# EAGLE design STAND_ALONE_TEST (EAGLE 6.2)
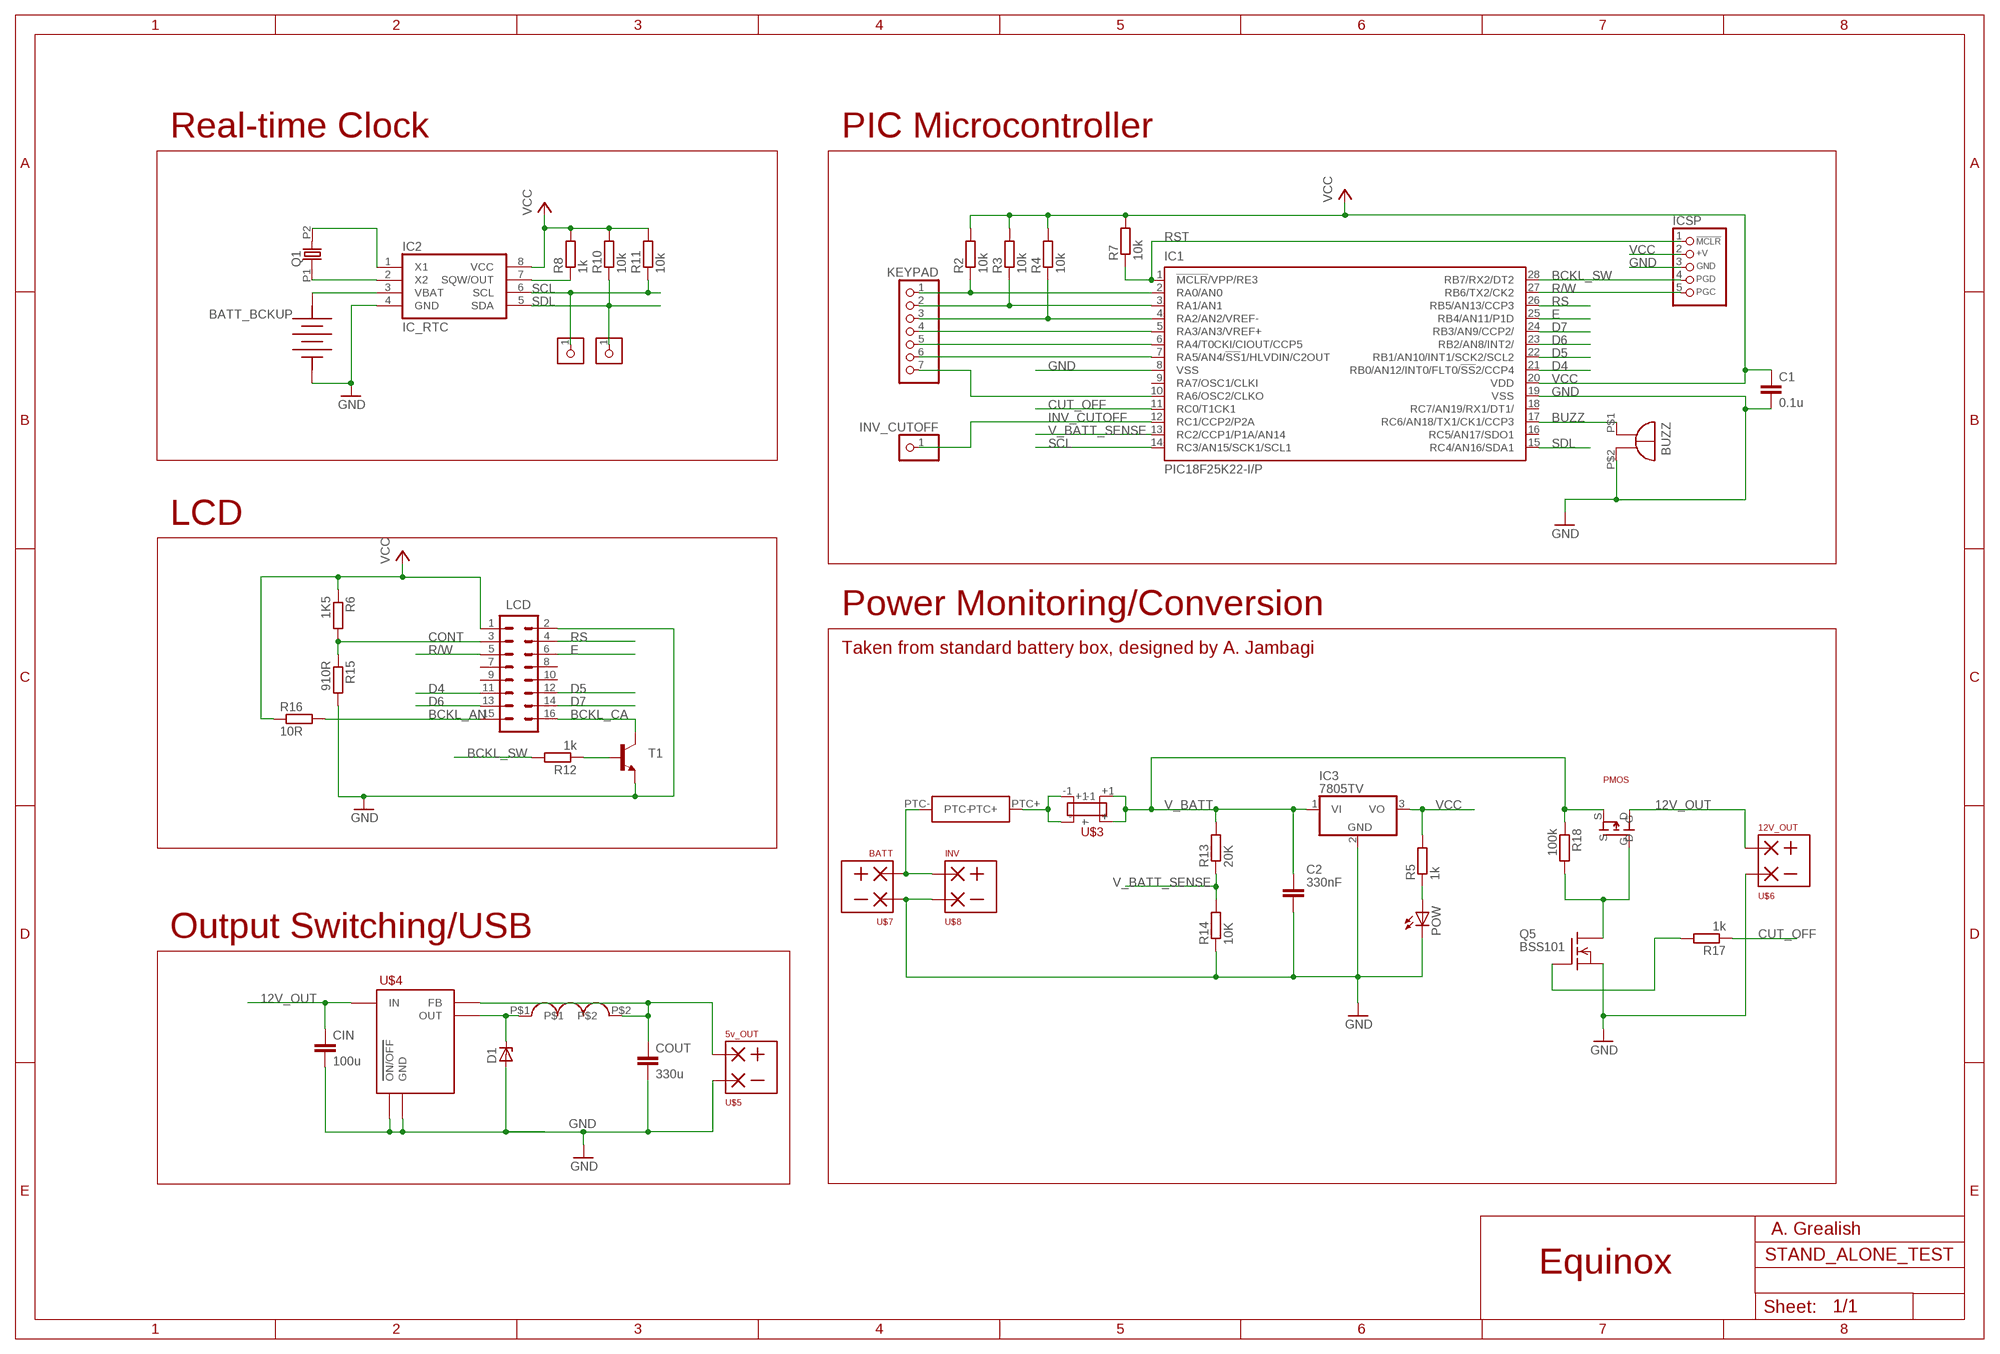
[diagram p0: schematic, sheet 1]

## Parts
BATT_BCKUP  RENATA_COIN_CELL  PANASONIC_CR2032_1298246  [PANASONIC_CR2032_1298246]
BUZZ  BUZZ_14MM  [14MM_5M_PINS]
C1  0.1u  CAPPTH2  [CAP-PTH-SMALL2]
C2  330nF  CAPACITOR_NPOL-PTH_0.1"  [C0.1PTH]
CIN  100u  C2.5/2  [C2.5-2]
COUT  330u  C2.5/2  [C2.5-2]
D1  ZENER-DIODEDO41Z10  [DO41Z10]
IC1  PIC18F25K22-I/P  [DIP28]
IC2  IC_RTC  IC_RTC_DS1307_DIP8  [DIP8]
IC3  7805TV  [TO220V]
ICSP  CON_HEADER_PRG_PIC_ICSPA  [HEADER_PRG_1X05]
INV_CUTOFF  PINHD-1X1  [1X01]
KEYPAD  PINHD-1X7  [1X07]
LCD  M08X2-SHROUDED_LOCK  [2X8-SHROUDED_LOCK]
PMOS  PMOS  [NMOS_IPAK]
POW  LED5MM  [LED5MM]
Q1  OSC-XTALTC-26  [TC-26]
Q5  BSS101  [TO92]
R2  10k  RESISTOR-PTH-0.4  [RTH025W]
R3  10k  RESISTOR-PTH-0.4  [RTH025W]
R4  10k  RESISTOR-PTH-0.4  [RTH025W]
R5  1k  RESISTOR-PTH-0.4  [RTH025W]
R6  1K5  RESISTOR-PTH-0.4  [RTH025W]
R7  10k  RESISTOR-PTH-0.4  [RTH025W]
R8  1k  RESISTOR-PTH-0.4  [RTH025W]
R10  10k  RESISTOR-PTH-0.4  [RTH025W]
R11  10k  RESISTOR-PTH-0.4  [RTH025W]
R12  1k  RESISTOR-PTH-0.4  [RTH025W]
R13  20K  RESISTOR-PTH-0.4  [RTH025W]
R14  10K  RESISTOR-PTH-0.4  [RTH025W]
R15  910R  RESISTOR-PTH-0.4  [RTH025W]
R16  10R  RESISTOR-PTH-0.4  [RTH025W]
R17  1k  RESISTOR-PTH-0.4  [RTH025W]
R18  100k  RESISTOR-PTH-0.4  [RTH025W]
T1  BC546-NPN-TO92-CBE  [TO92-CBE]
TP_SCL  CON_HEADER_1X01-PTH  [M1X1]
TP_SDL  CON_HEADER_1X01-PTH  [M1X1]
U$1  EQBX_INDUCTOR2  [INDUCTOR]
U$2  EQBX_PTCEQBX_PTC  [EQBX_PTC]
U$3  EQBX_FUSEEQBX_FUSE  [EQBX_FUSE]
U$4  LM2575  [TO220-5]
U$5  5v_OUT  TERMINAL_2WAY  [TERMINAL_2WAY]
U$6  12V_OUT  TERMINAL_2WAY  [TERMINAL_2WAY]
U$7  BATT  TERMINAL_2WAY  [TERMINAL_2WAY]
U$8  INV  TERMINAL_2WAY  [TERMINAL_2WAY]

## Nets
12V_OUT [pow_12v]: CIN.1 PMOS.D U$4.P$1(IN) U$6.P$1
BCKL_AN: LCD.15 R16.2
BCKL_CA: LCD.16 T1.C
BCKL_SW: IC1.28(RB7/RX2/DT2) ICSP.4(PGD) R12.2
BUZZ: BUZZ.P$1(+) IC1.17(RC6/AN18/TX1/CK1/CCP3)
CONT: LCD.3 R6.2 R15.1
CUT_OFF: IC1.11(RC0/T1CK1) R17.1
D4: IC1.21(RB0/AN12/INT0/FLT0/!SS!2/CCP4) LCD.11
D5: IC1.22(RB1/AN10/INT1/SCK2/SCL2) LCD.12
D6: IC1.23(RB2/AN8/INT2/) LCD.13
D7: IC1.24(RB3/AN9/CCP2/) LCD.14
E: IC1.25(RB4/AN11/P1D) LCD.6
GND [gnd]: BATT_BCKUP.P-(NEG) BUZZ.P$2(-) C1.2 C2.2 CIN.2 COUT.2 D1.A IC1.8(VSS) IC1.19(VSS) IC2.4(GND) IC3.2(GND) ICSP.3(GND) LCD.2 POW.K(C) Q5.1(S) R14.1 R15.2 T1.E U$4.P$3(GND) U$4.P$5(ON/OFF) U$5.P$2 U$6.P$2 U$7.P$2 U$8.P$2
INV_CUTOFF: IC1.12(RC1/CCP2/P2A) INV_CUTOFF.1
N$1: PMOS.G Q5.3(D) R18.2
N$2: R12.1 T1.B
N$4 [pow_12v]: U$2.PTC- U$7.P$1 U$8.P$1
N$9: IC1.2(RA0/AN0) KEYPAD.1 R2.1
N$10: IC1.3(RA1/AN1) KEYPAD.2 R3.1
N$11: IC1.4(RA2/AN2/VREF-) KEYPAD.3 R4.1
N$12: POW.A R5.1
N$13: IC1.5(RA3/AN3/VREF+) KEYPAD.4
N$14: IC1.6(RA4/T0CKI/CIOUT/CCP5) KEYPAD.5
N$15: IC1.7(RA5/AN4/!SS!1/HLVDIN/C2OUT) KEYPAD.6
N$16: IC1.10(RA6/OSC2/CLKO) KEYPAD.7
N$19: Q5.2(G) R17.2
N$22: IC2.2(X2) Q1.P1
N$23: IC2.1(X1) Q1.P2
N$24: IC2.7(SQW/OUT) R8.1
N$26: BATT_BCKUP.P+(POS) IC2.3(VBAT)
N$27 [pow_5v]: COUT.1 U$1.P$2 U$4.P$4(FB) U$5.P$1
N$28 [pow_12v]: U$2.PTC+ U$3.- U$3.-1
N$30: D1.C U$1.P$1 U$4.P$2(OUT)
R/W: IC1.27(RB6/TX2/CK2) ICSP.5(PGC) LCD.5
RS: IC1.26(RB5/AN13/CCP3) LCD.4
RST: IC1.1(!MCLR!/VPP/RE3) ICSP.1(/MCLR) R7.1
SCL: IC1.14(RC3/AN15/SCK1/SCL1) IC2.6(SCL) R11.1 TP_SCL.1
SDL: IC1.15(RC4/AN16/SDA1) IC2.5(SDA) R10.1 TP_SDL.1
V_BATT [pow_12v]: C2.1 IC3.1(VI) PMOS.S R13.2 R18.1 U$3.+ U$3.+1
V_BATT_SENSE: IC1.13(RC2/CCP1/P1A/AN14) R13.1 R14.2
VCC [pow_5v]: C1.1 IC1.20(VDD) IC2.8(VCC) IC3.3(VO) ICSP.2(+V) LCD.1 R2.2 R3.2 R4.2 R5.2 R6.1 R7.2 R8.2 R10.2 R11.2 R16.1
Unconnected: IC1.9(RA7/OSC1/CLKI) IC1.16(RC5/AN17/SDO1) IC1.18(RC7/AN19/RX1/DT1/) LCD.7 LCD.8 LCD.9 LCD.10

## Notes on the sheet
- Real-time Clock | PIC Microcontroller
- LCD
- Power Monitoring/Conversion
- Taken from standard battery box, designed by A. Jambagi
- Output Switching/USB
- A. Grealish
- Equinox

## Library data of the parts
BATT_BCKUP = coin_cells:PANASONIC_CR2032_1298246: Farnell Part No: 1298246
BUZZ = buzzer:BUZZ_14MM
C1 = SparkFun:CAP: Capacitor Standard 0603 ceramic capacitor, and 0.1" leaded capacitor.
C2 = dp_devices:CAPACITOR_NPOL: Non-Polarized capacitor in various packages
CIN COUT = capacitor-wima:C: CAPACITOR naming: grid - package width
D1 = diode:ZENER-DIODE: Z-Diode
IC1 = pic18f25k22:PIC18F25K22: PIC18F25K22 28 pin DIP
IC2 = dp_devices:IC_RTC_DS1307
IC3 = linear:78*: Positive VOLTAGE REGULATOR Source: http://cache.national.com/ds/LM/LM78L05.pdf http://www.fairchildsemi.com/ds/LM/LM7805.pdf
ICSP = dp_devices:CON_HEADER_PRG_PIC_ICSP: 5-pin PIC In Circuit Serial Programming header
INV_CUTOFF = pinhead:PINHD-1X1: PIN HEADER
KEYPAD = pinhead:PINHD-1X7: PIN HEADER
LCD = SparkFun:M08X2
PMOS = PMOS:PMOS
POW = led:LED: LED OSRAM: - CHIPLED LG R971, LG N971, LY N971, LG Q971, LY Q971, LO R971, LY R971 LH N974, LH R974 LS Q976, LO Q976, LY Q976 LO Q996 - Hyper CHIPLED LW Q18S LB Q993, LB Q99A, LB R99A - SideLED LS A670, LO A670, LY A670, LG A670, LP A670 LB A673, LV A673, LT A673, LW A673 LH A674 LY A675 LS A676, LA A676, LO A676, LY A676, LW A676 LS A679, LY A679, LG A679 - Hyper Micro SIDELED® LS Y876, LA Y876, LO Y876, LY Y876 LT Y87S - SmartLED LW L88C, LW L88S LB L89C, LB L89S, LG L890 LS L89K, LO L89K, LY L89K LS L896, LA L896, LO L896, LY L896 - TOPLED LS T670, LO T670, LY T670, LG T670, LP T670 LSG T670, LSP T670, LSY T670, LOP T670, LYG T670 LG T671, LOG T671, LSG T671 LB T673, LV T673, LT T673, LW T673 LH T674 LS T676, LA T676, LO T676, LY T676, LB T676, LH T676, LSB T676, LW T676 LB T67C, LV T67C, LT T67C, LS T67K, LO T67K, LY T67K, LW E67C LS E67B, LA E67B, LO E67B, LY E67B, LB E67C, LV E67C, LT E67C LW T67C LS T679, LY T679, LG T679 LS T770, LO T770, LY T770, LG T770, LP T770 LB T773, LV T773, LT T773, LW T773 LH T774 LS E675, LA E675, LY E675, LS T675 LS T776, LA T776, LO T776, LY T776, LB T776 LHGB T686 LT T68C, LB T68C - Hyper Mini TOPLED® LB M676 - Mini TOPLED Santana® LG M470 LS M47K, LO M47K, LY M47K Source: http://www.osram.convergy.de LUXEON: - LUMILED® LXK2-PW12-R00, LXK2-PW12-S00, LXK2-PW14-U00, LXK2-PW14-V00 LXK2-PM12-R00, LXK2-PM12-S00, LXK2-PM14-U00 LXK2-PE12-Q00, LXK2-PE12-R00, LXK2-PE12-S00, LXK2-PE14-T00, LXK2-PE14-U00 LXK2-PB12-K00, LXK2-PB12-L00, LXK2-PB12-M00, LXK2-PB14-N00, LXK2-PB14-P00, LXK2-PB14-Q00 LXK2-PR12-L00, LXK2-PR12-M00, LXK2-PR14-Q00, LXK2-PR14-R00 LXK2-PD12-Q00, LXK2-PD12-R00, LXK2-PD12-S00 LXK2-PH12-R00, LXK2-PH12-S00 LXK2-PL12-P00, LXK2-PL12-Q00, LXK2-PL12-R00 Source: www.luxeon.com KINGBRIGHT: KA-3528ASYC Source: www.kingbright.com
Q1 = dp_devices:OSC-XTAL
Q5 = transistor-fet:BSS101: N-Channel Enhancement MOSFET 200V; 0,16A; 11Ohm
R2-R8 R10-R18 = dp_devices:RESISTOR
T1 = transistor:*-NPN-: NPN Transistror BF959 corrected 2008.03.06
TP_SCL TP_SDL = dp_devices:CON_HEADER_1X01
U$1 = inductor:EQBX_INDUCTOR2
U$2 = eqbx_ptc:EQBX_PTC
U$3 = eqbx_fuse:EQBX_FUSE
U$4 = LM2575_TO220:LM2575
U$5-U$8 = terminal_2way:TERMINAL_2WAY

## Net classes
0 default: width 0.381 mm, drill 0.61 mm, clearance 0.381 mm
1 pow_5v: width 0.762 mm, drill 0.762 mm, clearance 0.762 mm
2 pow_12v: width 1.372 mm, drill 0.762 mm, clearance 0.762 mm
3 gnd: width 0.508 mm, drill 0.61 mm

## Board
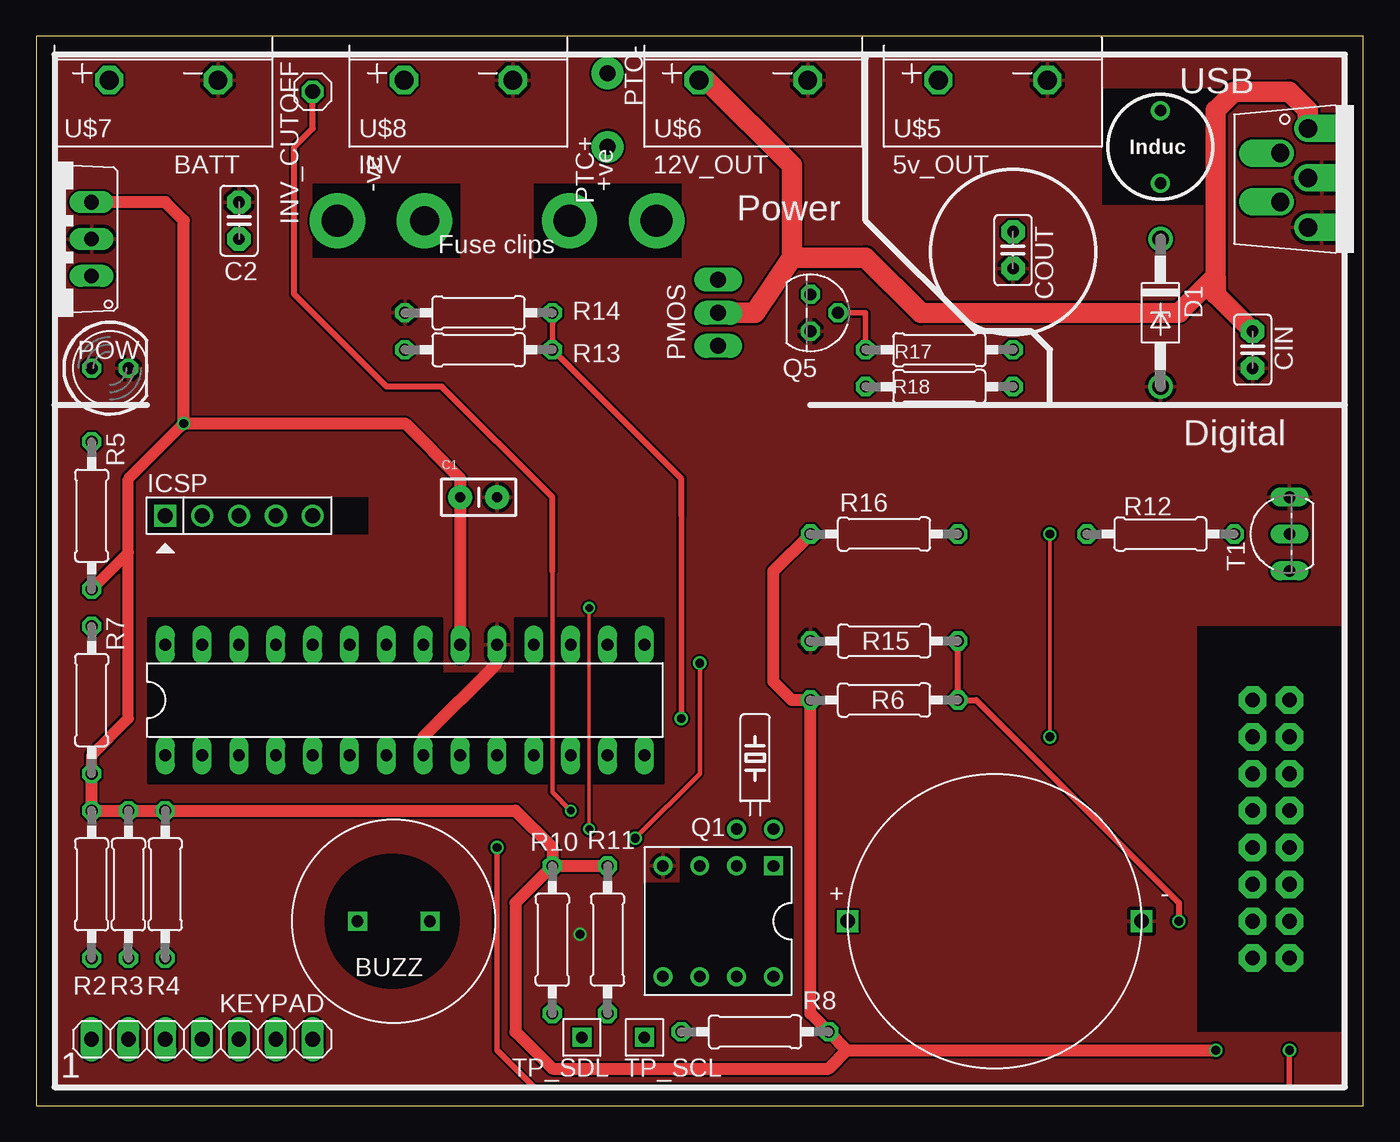
[diagram p1: board, top side]
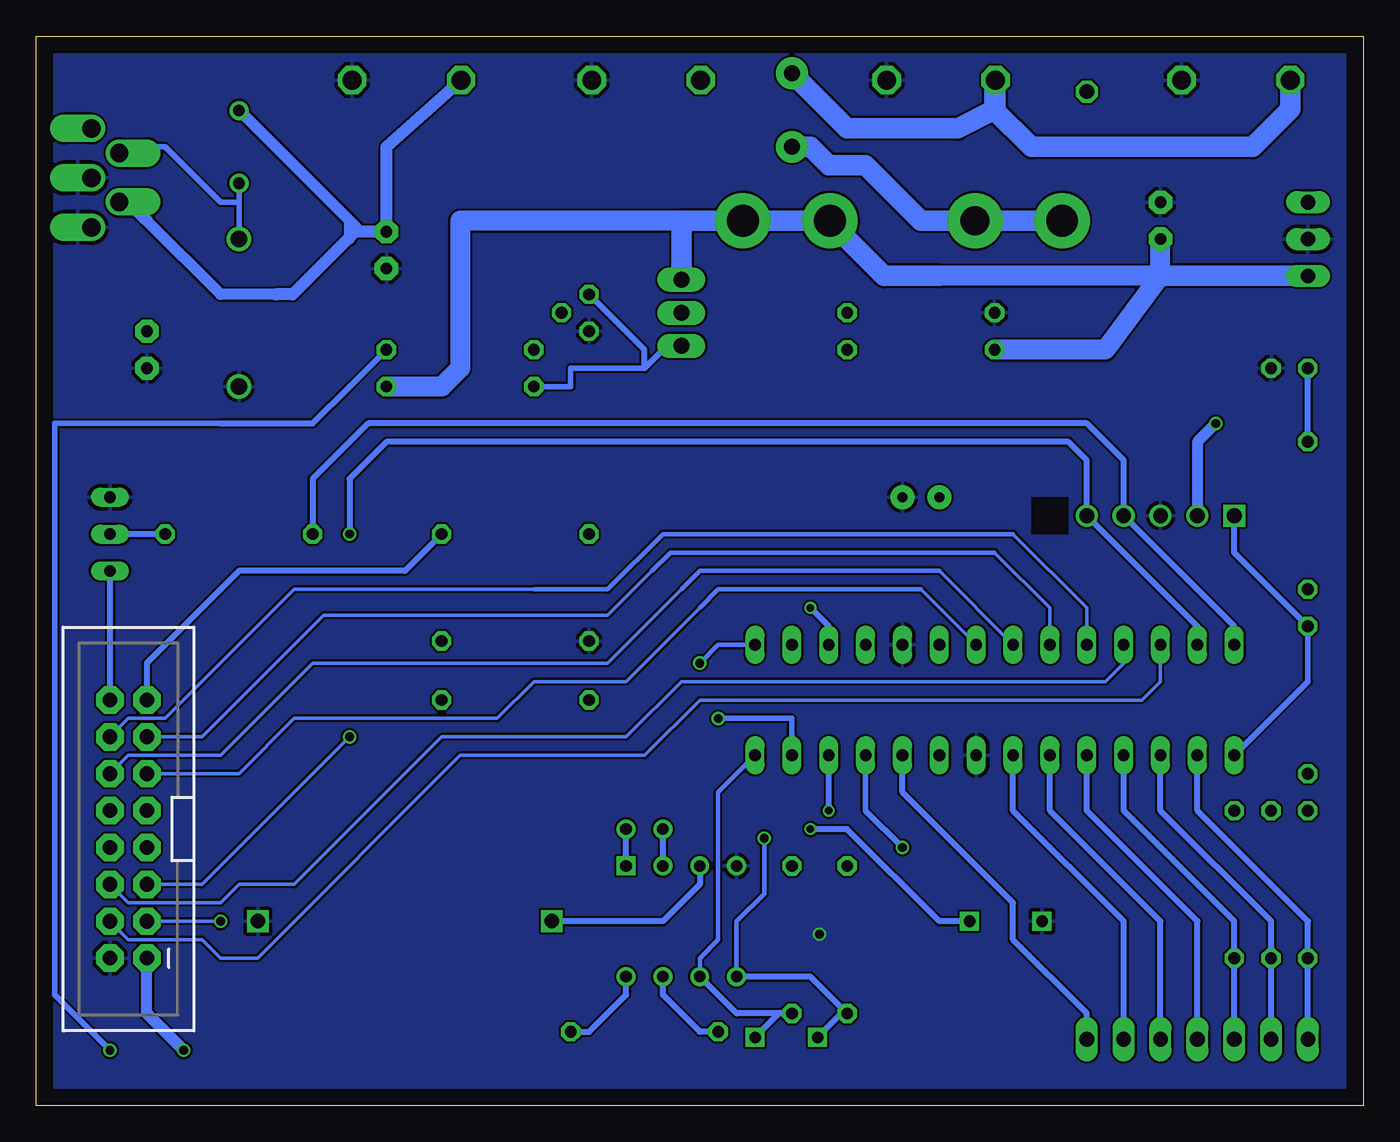
[diagram p2: board, bottom side, seen from below]

Size 91.44 x 73.66 mm. Coordinates in mm from the lower left corner, seen from the top.
Outline: 0,0 91.44,0 91.44,73.66 0,73.66 0,0
Copper layers (1*16): Top 0.035mm / dielectric 1.5mm / Bottom 0.035mm
Design rules: minimum track width 6mil, minimum drill 12mil, track to track 6mil, track to pad 6mil, pad to pad 6mil, via to via 6mil, smd to smd 0mil, copper to edge 10mil, drill to drill 10mil, minimum pad ring 10mil, minimum via ring 6mil, stop-mask expansion 2mil, vias tented up to drill 100mil, thermal gap 10mil
tRestrict: area 23.1,11.3 to 25.9,14.1; area 80,5.1 to 90.2,33; area 7.6,39.4 to 22.9,41.9; area 19.1,58.4 to 29.2,63.5; area 34.3,58.4 to 44.5,63.5; area 7.7,22.2 to 43.2,33.5; area 41.9,7.6 to 52.1,17.8
bRestrict: area 20.3,39.4 to 22.9,41.9

### Footprints (pad centres in the part's own frame; a part is rotated, then mirrored left to right if it is on the bottom)
PANASONIC_CR2032_1298246 = drill 1 square: P+ -10.125,0; P- 10.125,0
14MM_5M_PINS = drill 0.8 square: P$1 -3,0; P$2 2,0
CAP-PTH-SMALL2 = drill 0.7 pad 1.651: 1 0,0; 2 2.54,0
C0.1PTH = drill 0.813 pad 1.6 octagon: 1 -1.27,0; 2 1.27,0
C2.5-2 = drill 0.813 pad 1.6 octagon: 1 -1.27,0; 2 1.27,0
DO41Z10 = drill 1.118: A 5.08,0; C -5.08,0
DIP28 = drill 0.813 long: 1 -16.51,-3.81; 2 -13.97,-3.81; 3 -11.43,-3.81; 4 -8.89,-3.81; 5 -6.35,-3.81; 6 -3.81,-3.81; 7 -1.27,-3.81; 8 1.27,-3.81; 9 3.81,-3.81; 10 6.35,-3.81; 11 8.89,-3.81; 12 11.43,-3.81; 13 13.97,-3.81; 14 16.51,-3.81; 15 16.51,3.81; 16 13.97,3.81; 17 11.43,3.81; 18 8.89,3.81; 19 6.35,3.81; 20 3.81,3.81; 21 1.27,3.81; 22 -1.27,3.81; 23 -3.81,3.81; 24 -6.35,3.81; 25 -8.89,3.81; 26 -11.43,3.81; 27 -13.97,3.81; 28 -16.51,3.81
DIP8 = drill 0.8 square: 1 -3.81,-3.81 | drill 0.8: 2 -1.27,-3.81; 3 1.27,-3.81; 4 3.81,-3.81; 5 3.81,3.81; 6 1.27,3.81; 7 -1.27,3.81; 8 -3.81,3.81
TO220V = drill 1.016 long: 1 -2.54,-2.54; 2 0,-2.54; 3 2.54,-2.54
HEADER_PRG_1X05 = drill 1.016 square: 1 -5.08,0 | drill 1.016: 2 -2.54,0; 3 0,0; 4 2.54,0; 5 5.08,0
1X01 = drill 1.016 octagon: 1 0,0
1X07 = drill 1.016 long: 1 -7.62,0; 2 -5.08,0; 3 -2.54,0; 4 0,0; 5 2.54,0; 6 5.08,0; 7 7.62,0
2X8-SHROUDED_LOCK = drill 1.016 pad 1.88 octagon: 1 -1.27,8.89; 2 1.27,8.89; 3 -1.27,6.35; 4 1.27,6.35; 5 -1.27,3.81; 6 1.27,3.81; 7 -1.27,1.27; 8 1.27,1.27; 9 -1.27,-1.27; 10 1.27,-1.27; 11 -1.27,-3.81; 12 1.27,-3.81; 13 -1.27,-6.35; 14 1.27,-6.35; 15 -1.27,-8.89; 16 1.27,-8.89
NMOS_IPAK = drill 1.1 long: D 0,0; G -2.28,0; S 2.28,0
LED5MM = drill 0.813 octagon: A -1.27,0; K 1.27,0
TC-26 = drill 0.8: P1 -1.27,-2.54; P2 1.27,-2.54
TO92 = drill 0.813 octagon: 1 1.27,0; 2 0,1.905; 3 -1.27,0
RTH025W = drill 0.813 octagon: 1 -5.08,0; 2 5.08,0
TO92-CBE = drill 0.813 long: B 0,0; C -2.54,0; E 2.54,0
M1X1 = drill 0.8 square: 1 0,0
INDUCTOR = drill 0.8: P$1 2.5,0; P$2 -2.5,0
EQBX_PTC = drill 1.1 pad 2.184: PTC+ 2.54,0; PTC- -2.54,0
EQBX_FUSE = drill 2.2 pad 3.81: + 0,-5; +1 0,-11; -1 0,11 | drill 2 pad 3.81: - 0,5
TO220-5 = drill 1.27 offset: P$1 0,0; P$2 1.702,-1.905; P$3 3.404,0; P$4 5.055,-1.905; P$5 6.807,0
TERMINAL_2WAY = drill 1.3 octagon: P$1 3.75,4.6; P$2 11.25,4.6

### Placement (x,y rotation side)
BATT_BCKUP  66.04,12.7 0 top
BUZZ  24.13,12.7 180 top
C1  29.21,41.91 0 top
C2  13.97,60.96 90 top
CIN  83.82,52.07 270 top
COUT  67.31,58.93 270 top
D1  77.47,54.61 270 top
IC1  25.4,27.94 0 top
IC2  46.99,12.7 180 top
IC3  1.27,59.69 90 top
ICSP  13.97,40.64 0 top
INV_CUTOFF  19.05,69.85 0 top
KEYPAD  11.43,4.57 0 top
LCD  85.09,19.05 180 bottom
PMOS  46.99,54.61 90 top
POW  5.08,50.8 0 top
Q1  49.53,21.59 0 top
Q5  53.34,54.61 270 top
R2  3.81,15.24 90 top
R3  6.35,15.24 90 top
R4  8.89,15.24 90 top
R5  3.81,40.64 270 top
R6  58.42,27.94 0 top
R7  3.81,27.94 270 top
R8  49.53,5.08 0 top
R10  35.56,11.43 90 top
R11  39.37,11.43 90 top
R12  77.47,39.37 180 top
R13  30.48,52.07 180 top
R14  30.48,54.61 0 top
R15  58.42,32 180 top
R16  58.42,39.37 0 top
R17  62.23,52.07 180 top
R18  62.23,49.53 180 top
T1  86.36,39.37 90 top
TP_SCL  41.91,4.7 90 top
TP_SDL  37.59,4.7 0 top
U$1  77.47,66.04 270 top
U$2  39.37,68.58 270 top
U$3  31.75,60.96 90 top
U$4  87.63,67.31 270 top
U$5  58.42,66.04 0 top
U$6  41.91,66.04 0 top
U$7  1.27,66.04 0 top
U$8  21.59,66.04 0 top

### Tracks (layer width: path | path; a pad name or v marks a point on that pad's centre or on a via)
12V_OUT
  Top 1.372: CIN.1 81.28,55.88 81.28,57.15 | 81.28,57.15 81.28,68.58 82.55,69.85 | 81.28,57.15 78.74,54.61 60.96,54.61
  Top 1.422: PMOS.D 49.53,54.61 52.07,58.42 | 60.96,54.61 57.15,58.42 52.07,58.42 | 52.07,58.42 52.07,64.77 46.2,70.64 U$6.P$1 | U$4.P$1 87.63,68.58 86.36,69.85 82.55,69.85
BCKL_AN
  Bottom 0.406: LCD.15 83.82,30.48 77.47,36.83 66.04,36.83 R16.2
BCKL_CA
  Bottom 0.406: LCD.16 T1.C
BCKL_SW
  Bottom 0.406: IC1.28 8.89,33.02 ICSP.4 16.51,44.45 19.05,46.99 68.58,46.99 72.39,43.18 R12.2
BUZZ  (via drill 0.51)
  Top 0.254: v38.1,19.05 v38.1,34.29
  Bottom 0.406: BUZZ.P$1 29.21,12.7 35.56,19.05 v38.1,19.05 | v38.1,34.29 36.83,33.02 IC1.17
CONT  (via drill 0.61)
  Top 0.406: v78.74,12.7 78.74,13.97 64.77,27.94 R6.2 R15.1
  Bottom 0.254: v78.74,12.7 LCD.3
CUT_OFF  (via drill 0.61)
  Top 0.381: v31.75,17.78 31.75,3.81 34.29,1.27 86.36,1.27 v86.36,3.81
  Bottom 0.381: IC1.11 34.29,20.32 v31.75,17.78 | v86.36,3.81 90.17,7.62 90.17,46.99 78.74,46.99 | 69.85,49.53 R17.1
  Bottom 0.406: 69.85,49.53 72.39,46.99 78.74,46.99
D4
  Bottom 0.254: IC1.21 30.48,35.56 | 45.72,34.29 50.8,29.21 57.15,29.21 59.69,26.67 73.66,26.67 77.47,22.86 LCD.11
  Bottom 0.305: 45.72,34.29 44.45,35.56 30.48,35.56
D5
  Bottom 0.254: LCD.12 85.09,24.13 78.74,24.13 72.39,30.48 52.07,30.48 46.99,35.56 | IC1.22 29.21,36.83
  Bottom 0.305: 29.21,36.83 45.72,36.83 46.99,35.56
D6
  Bottom 0.254: IC1.23 21.59,34.29 25.4,38.1 | 49.02,36.83 52.07,33.78 71.63,33.78 80.01,25.4 LCD.13
  Bottom 0.305: 49.02,36.83 47.75,38.1 25.4,38.1
D7
  Bottom 0.254: LCD.14 85.09,26.67 82.55,26.67 73.66,35.56 57.15,35.56 | 24.13,39.37 19.05,34.29 IC1.24
  Bottom 0.305: 24.13,39.37 48.26,39.37 52.07,35.56 57.15,35.56
E
  Bottom 0.254: LCD.6 85.09,13.97 78.74,13.97 77.47,15.24 73.66,15.24 63.5,25.4 50.8,25.4 46.99,29.21 17.78,29.21 16.51,30.48 IC1.25
GND  (via drill 0.61)
  Top 0.813: IC1.8 26.67,25.4 31.75,30.48 IC1.19
  other vias: 37.47,11.81
  pour Bottom: 1.27,1.27 90.17,1.27 90.17,72.39 1.27,72.39
  pour Top: 1.27,1.27 1.27,72.39 90.17,72.39 90.17,1.27
INV_CUTOFF  (via drill 0.51)
  Top 0.305: v36.83,20.32 35.56,21.59 35.56,36.83
  Top 0.406: INV_CUTOFF.1 19.05,67.31 17.78,66.04 17.78,55.88 24.13,49.53 27.94,49.53 35.56,41.91 35.56,36.83
  Bottom 0.406: v36.83,20.32 IC1.12
N$1
  Bottom 0.381: R18.2 54.61,49.53 54.61,50.8 49.53,50.8 48.26,52.07 46.99,52.07 PMOS.G
  Bottom 0.406: 49.53,50.8 49.53,52.07 Q5.3
N$2
  Bottom 0.406: R12.1 T1.B
N$4
  Bottom 1.422: U$7.P$1 5.02,68.64 7.62,66.04 22.86,66.04 25.4,68.58 25.4,70.58 U$8.P$1 25.34,68.64 27.94,67.31 35.56,67.31 U$2.PTC-
N$9
  Bottom 0.406: KEYPAD.1 R2.1 3.81,12.7 11.43,20.32 IC1.2
N$10
  Bottom 0.406: KEYPAD.2 R3.1 6.35,12.7 13.97,20.32 IC1.3
N$11
  Bottom 0.406: KEYPAD.3 R4.1 8.89,12.7 16.51,20.32 IC1.4
N$12
  Bottom 0.406: R5.1 POW.A
N$13
  Bottom 0.406: KEYPAD.4 11.43,12.7 19.05,20.32 IC1.5
N$14
  Bottom 0.406: IC1.6 21.59,20.32 13.97,12.7 KEYPAD.5
N$15
  Bottom 0.406: KEYPAD.6 16.51,12.7 24.13,20.32 IC1.7
N$16
  Bottom 0.406: KEYPAD.7 19.05,6.35 24.13,11.43 24.13,13.97 31.75,21.59 IC1.10
N$19
  Top 0.381: R17.2 57.15,54.61 Q5.2
N$22
  Bottom 0.406: IC2.2 Q1.P1
N$23
  Bottom 0.406: IC2.1 Q1.P2
N$24
  Bottom 0.406: R8.1 45.72,5.08 48.26,7.62 IC2.7
N$26
  Bottom 0.406: IC2.3 45.72,15.24 48.26,12.7 BATT_BCKUP.P+
N$27
  Bottom 0.762: 74.93,55.88 78.74,55.88 83.82,60.96 | 69.85,60.96 69.34,60.45 | 69.85,60.96 77.47,68.58 U$1.P$2 | 69.85,60.96 69.85,59.69 69.91,59.75 | 85.09,62.23 U$4.P$4
  Bottom 0.813: U$5.P$1 67.31,66.04 COUT.1 69.47,60.2 69.91,59.75 73.79,55.88 74.93,55.88 | 83.82,60.96 85.09,62.23
N$28
  Bottom 1.422: U$3.-1 U$3.- 30.48,60.96 34.29,64.77 36.83,64.77 38.1,66.04 U$2.PTC+
N$30
  Bottom 0.381: D1.C 77.47,62.23 | 77.47,62.23 U$1.P$1 | 77.47,62.23 78.74,62.23 82.55,66.04 85.09,66.04 U$4.P$2
R/W  (via drill 0.61)
  Top 0.254: v69.85,39.37 v69.85,25.4
  Bottom 0.254: LCD.5 80.01,15.24 v69.85,25.4
  Bottom 0.406: IC1.27 11.43,33.02 ICSP.5 19.05,44.45 20.32,45.72 67.31,45.72 69.85,43.18 v69.85,39.37
RS
  Bottom 0.254: LCD.4 85.09,11.43 80.01,11.43 78.74,10.16 76.2,10.16 62.23,24.13 49.53,24.13 45.72,27.94 15.24,27.94 13.97,29.21 IC1.26
RST
  Bottom 0.381: IC1.1 3.81,29.21 R7.1
  Bottom 0.406: R7.1 8.89,38.1 ICSP.1
SCL
  Bottom 0.305: IC2.6 45.72,10.16 44.45,11.43 44.45,21.59 IC1.14
  Bottom 0.406: IC2.6 43.18,6.35 R11.1 40.26,6.35 TP_SCL.1
SDL  (via drill 0.61)
  Top 0.305: v41.27,18.41 45.72,22.86 v45.72,30.48
  Bottom 0.305: IC2.5 43.18,12.7 41.27,14.61 v41.27,18.41 | v45.72,30.48 44.45,31.75 IC1.15
  Bottom 0.406: IC2.5 38.1,8.89 R10.1 35.94,6.35 TP_SDL.1
V_BATT
  Bottom 1.372: 36.83,60.96 U$3.+ | U$3.+1 43.18,60.96 | 13.97,57.15 29.21,57.15 | R18.1 63.5,49.53 62.23,50.8 62.23,60.96 46.99,60.96 | 46.99,57.15 PMOS.S | R13.2 17.78,52.07 13.97,57.15 | 13.97,57.15 C2.1
  Bottom 1.422: 36.83,60.96 U$3.+1 46.99,60.96 46.99,57.15 | IC3.1 13.97,57.15 | 29.21,57.15 33.02,57.15 36.83,60.96 | 36.83,60.96 36.83,60.88 U$3.+
V_BATT_SENSE  (via drill 0.61)
  Top 0.381: R13.1 R14.2 | v44.45,26.67 44.45,40.64
  Top 0.406: 44.45,40.64 44.45,43.18 R13.1
  Bottom 0.381: IC1.13 39.37,26.67 v44.45,26.67
VCC  (via drill 0.61)
  Top 0.762: 6.35,38.1 R5.2 | 6.35,38.1 6.35,43.18 v10.16,46.99 | 6.35,38.1 6.35,26.67 3.81,24.13 R7.2
  Top 0.813: 55.88,3.81 v81.28,3.81 | 55.88,3.81 R8.2 53.34,6.35 R6.1 52.07,27.94 50.8,29.21 50.8,36.83 R16.1 | IC1.20 C1.1 29.21,43.18 25.4,46.99 v10.16,46.99 10.16,60.96 8.89,62.23 IC3.3 | R7.2 R2.2 R3.2 R4.2 33.02,20.32 35.56,17.78 R10.2 | R10.2 R11.2 | R10.2 33.02,13.97 33.02,5.08 35.56,2.54 54.61,2.54 55.88,3.81
  Bottom 0.406: R8.2 53.34,5.08 50.8,7.62 IC2.8
  Bottom 0.762: ICSP.2 11.43,45.72 v10.16,46.99 | 83.82,6.35 LCD.1
  Bottom 0.813: v81.28,3.81 83.82,6.35

### Text on the board
tNames: USB | Induc | Power | Digital | 1
tDocu: Note: Resistor Values | changed from printed board | IDC mirrored to match reveresed solder on LCD. Place on top side
200bmp: Box ID: